# Altium schematic sheet Sheet7.SchDoc: solar-powered-remote-water-level-relay
size 419 x 297 mm; Date: 2026/06/29; Author: forlook88@gmail.com; Revision: 0; SheetNumber: 7; SheetTotal: 11
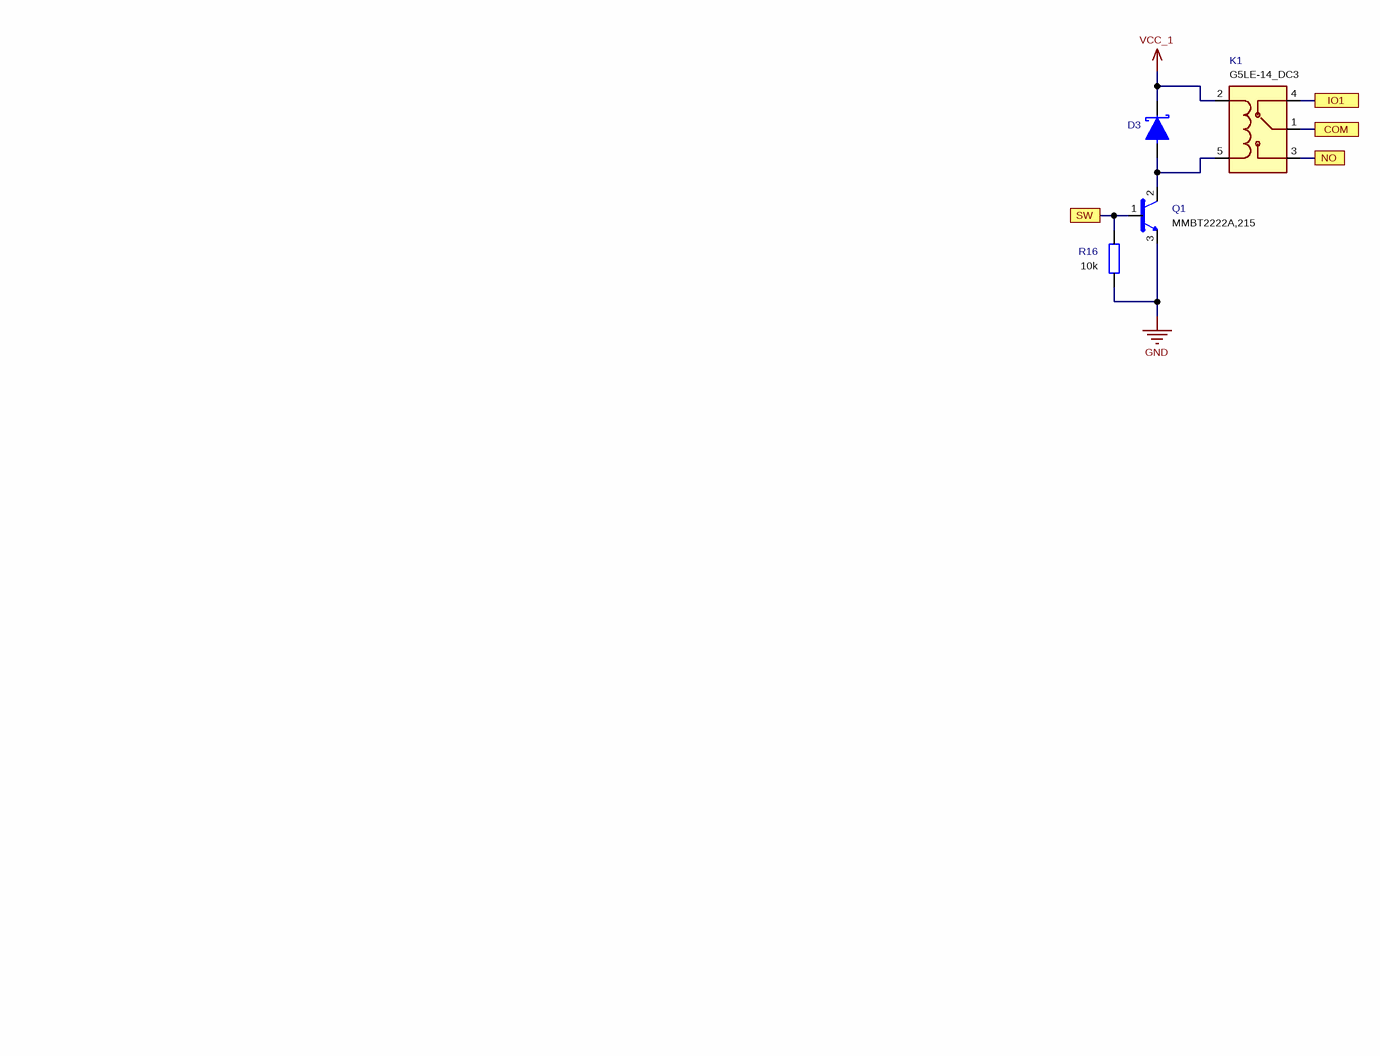
[diagram p0: Sheet7.SchDoc]

## Parts
D3  (no value)
K1  value G5LE-14_DC3
Q1  value MMBT2222A,215
R16  value 10k

## Ports
COM, IO1, NO, SW

## Nets
GND: Q1.3(EMITTER) R16.1
VCC_1: D3.K K1.2(COIL1)
COM: K1.1(COM) ; port COM
IO1: K1.4(NC) ; port IO1
NO: K1.3(NO) ; port NO
SW: Q1.1(BASE) R16.2 ; port SW
NetD3_A: D3.A K1.5(COIL2) Q1.2(COLLECTOR)

## Notes on the sheet
- Document Name:
- Project Name:
- Sheet Name:
- Sheet Number:
- Author:
- CELUS Design Platform electronic designs are machine-generated drafts and require verification by qualified specialists.
- of
- Revision:
- Date:
- By using these designs, you agree to the CELUS Terms of Use: https://www.celus.io/terms-of-use

## Library data of the parts
D3 = (no symbol name): Manufacturer Part Number: MBR140SFT1G; Manufacturer: OnSemi
K1 = (no symbol name): Manufacturer: Omron Electronics; Manufacturer Part Number: G5LE-14_DC3
Q1 = (no symbol name): Manufacturer: Nexperia; Manufacturer Part Number: MMBT2222A,215
R16 = (no symbol name): Manufacturer Part Number: ERJ-2GEJ103X; Manufacturer: Panasonic